# Altium schematic sheet FullCircuit.SchDoc
size A; SheetNumber: 4; SheetTotal: 4
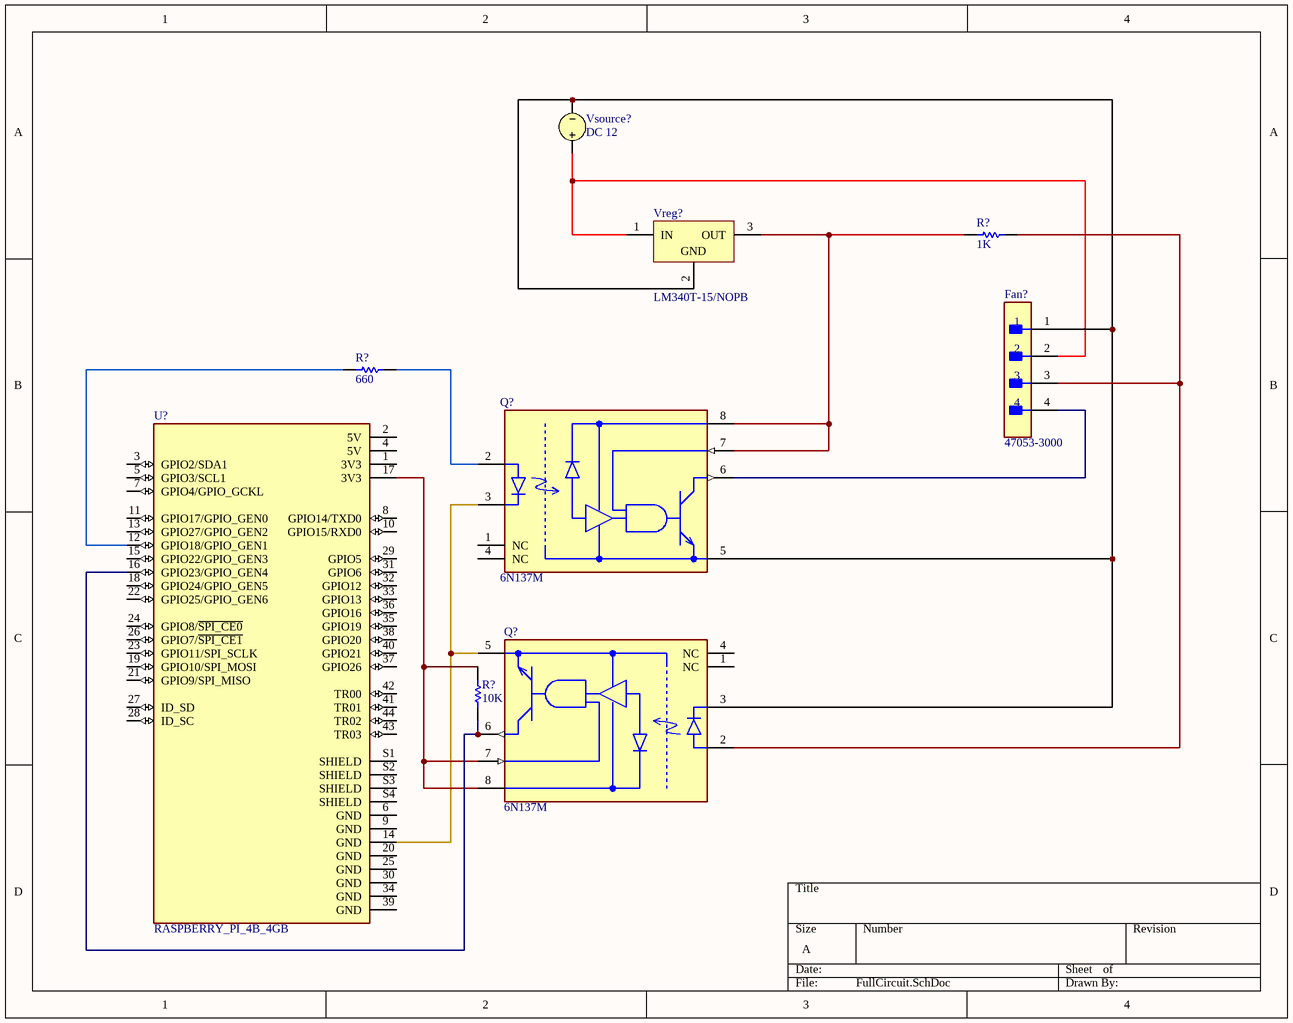
[diagram p0: FullCircuit.SchDoc]

## Parts
(Parts that share a designator on the sheet are numbered #1, #2 ... from top to bottom, then left to right.)
Fan?  47053-3000  [FP-47053-3000-MFG]
Q?#1  6N137M  [FP-646CQ-MFG]
Q?#2  6N137M  [FP-646CQ-MFG]
R?#1  value 1K  (hidden comment: Resistor)
R?#2  value 660  (hidden comment: Resistor)
R?#3  value 10K  (hidden comment: Resistor)
U?  RASPBERRY_PI_4B_4GB  [MODULE_RASPBERRY_PI_4B_4GB]
Vreg?  LM340T-15/NOPB  [NDE0003A]
Vsource?  DC 12

## Nets
NetFan?_1: Fan?.1 Q?#1.5(GND) Q?#2.3(C) Vreg?.2(GND) Vsource?.2
NetFan?_2: Fan?.2 Vreg?.1(IN) Vsource?.1
NetFan?_3: Fan?.3 Q?#2.2(A) R?#1.2
NetFan?_4: Fan?.4 Q?#1.6(VO)
NetQ?#1_2: Q?#1.2(A) R?#2.2
NetQ?#1_3: Q?#1.3(C) Q?#2.5(GND) U?.14(GND)
NetQ?#1_7: Q?#1.7(VE) Q?#1.8(VCC) R?#1.1 Vreg?.3(OUT)
NetQ?#2_6: Q?#2.6(VO) R?#3.1 U?.16(GPIO23/GPIO_GEN4)
NetQ?#2_7: Q?#2.7(VE) Q?#2.8(VCC) R?#3.2 U?.17(3V3)
NetR?#2_1: R?#2.1 U?.12(GPIO18/GPIO_GEN1)

Not connected (* = marked no-connect by the designer): Q?#1 1(NC) 4(NC); Q?#2 1(NC) 4(NC); U? 1(3V3) 2(5V) 3(GPIO2/SDA1) 4(5V) 5(GPIO3/SCL1) 6(GND) 7(GPIO4/GPIO_GCKL) 8(GPIO14/TXD0) 9(GND) 10(GPIO15/RXD0) 11(GPIO17/GPIO_GEN0) 13(GPIO27/GPIO_GEN2) 15(GPIO22/GPIO_GEN3) 18(GPIO24/GPIO_GEN5) 19(GPIO10/SPI_MOSI) 20(GND) 21(GPIO9/SPI_MISO) 22(GPIO25/GPIO_GEN6) 23(GPIO11/SPI_SCLK) 24(GPIO8/~{SPI_CE0}) 25(GND) 26(GPIO7/~{SPI_CE1}) 27(ID_SD) 28(ID_SC) 29(GPIO5) 30(GND) 31(GPIO6) 32(GPIO12) 33(GPIO13) 34(GND) 35(GPIO19) 36(GPIO16) 37(GPIO26) 38(GPIO20) 39(GND) 40(GPIO21) 41(TR01) 42(TR00) 43(TR03) 44(TR02) S1(SHIELD) S2(SHIELD) S3(SHIELD) S4(SHIELD)

## Library data of the parts
Fan? = CMP-04776-000447-1: CONN HEADER VERT 4POS 2.54MM; Glow Wire Compliant: Non-compliant; Voltage Rating: 250V; Current Rating: 4A; Number of Circuits: 4; Gender: Male; Orientation: Straight; Packaging: Bulk; Series: 47053; RoHS Compliant: Yes; Termination: Through Hole; Contact Plating: Tin; Mount: Through Hole; Number of Rows: 1; Pitch: 2.54mm; Halogen Free: Low Halogen; Number of Contacts: 4; Min Operating Temperature: 0°C; Package Quantity: 12000; Contact Material: Copper Alloy; Max Operating Temperature: 75°C; REACH SVHC: No SVHC; Number of Positions: 4
Q?#1 Q?#2 = CMP-07144-000008-1: OPTOISO 5KV 1CH OPEN COLL 8DIP; Manufacturer: ON Semiconductor; Max Junction Temp: +125°C; Forward Voltage: 1.45V; Min Supply Voltage: 4.5V; Reverse Voltage: 5V; Forward Current: 10mA; Max Supply Voltage: 5.5V; Turn On Delay Time: 40ns; Standoff Height: 0.51mm; Isolation Voltage: 5000Vrms; RoHS: TRUE; Ipc Land Pattern Name: DIP762W48P254L991H508Q8; Temperature Range Low: -40°C; Octopart: https://octopart.com/6n137m-on+semiconductor-84323399; ComponentLink2Description: Datasheet; Footprint Url: https://www.onsemi.com/pub/Collateral/646CQ.PDF; Mouser Description: Optocoupler Logic-Out Open Collector DC-IN 1-CH 8-Pin PDIP White Tube; Ambient Temperature Range Low: -40°C; Digikey Description: OPTOISO 5KV 1CH OPEN COLL 8DIP; ComponentLink2URL: https://www.onsemi.cn/PowerSolutions/document/HCPL2631M-D.pdf; Device Class L1: Optoelectronics; Category: Trans; Turn Off Delay Time: 40ns; Ambient Temperature Range High: +85°C; Temperature: -40°C to +125°C; Device Class L3: unset; Manufacturer Part Number: 6N137M; Lead Free: Yes; Temperature Range High: +125°C; Device Class L2: Optocouplers; Automotive: No; Package: 646CQ; Height: 5.08mm
R?#1-R?#3 = Resistor: TC1: 0; SimulationGenericComponent: True; TC2: 0
U? = RASPBERRY_PI_4B_4GB: BCM2711 Raspberry Pi 4 Model B 4GB - ARMÂ® CortexÂ®-A72 MPU Embedded Evaluation Board; MP: RASPBERRY PI 4B/4GB; Price: None; MF: Raspberry Pi; Check_prices: https://www.snapeda.com/parts/RASPBERRY%20PI%204B/4GB/Raspberry+Pi/view-part/?ref=eda; Value: *; Purchase-URL: https://pricing.snapeda.com/search/part/RASPBERRY PI 4B/4GB/?ref=eda; Availability: In Stock; SnapEDA_Link: https://www.snapeda.com/parts/RASPBERRY%20PI%204B/4GB/Raspberry+Pi/view-part/?ref=snap; Package: None
Vreg? = CMP-0062-02464-3: Series 3-Terminal Positive Regulators, 3-pin TO-220, Pb-Free; Manufacturer: Texas Instruments; PowerWise: N; PackageTopMarking: NSUZXYTTE#*LM340T15*7815 P+; CompType: LDO IC; PackageDescription: TO-220, Molded, 3 Lead, Straight; PackageReference: NDE0003A; ComponentLink1URL: http://www.ti.com/general/docs/lit/getliterature.tsp?genericPartNumber=LM340-N&fileType=pdf; PinCount: 3; RoHS: Y; ComponentLink1Description: Datasheet URL
Vsource? = VSRC: Voltage Source; Note: PCB Footprint - Not required; AC Magnitude: 1; AC Phase: 0; Value: 12; Published: 8-Jun-2000; LatestRevisionDate: 17-Jul-2002; LatestRevisionNote: Re-released for DXP Platform.; PackageReference: Not Applicable; Publisher: Altium Limited